# Altium schematic sheet POWER.SchDoc: =ProjectName
size A4; CheckedBy: DatNB; Author: Ven; CompanyName: Nacentech; Organization: IMET
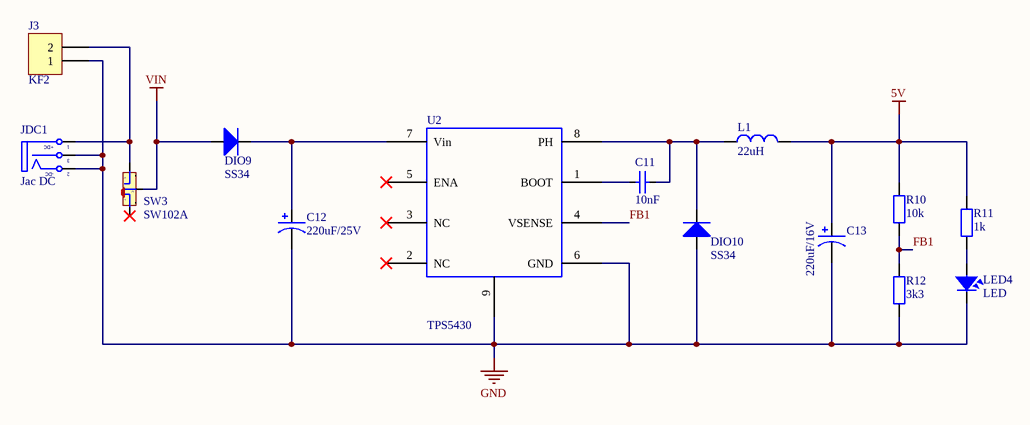
[diagram p0: POWER.SchDoc]

## Parts
C11  10nF  [CAP_0805]
C12  220uF/25V  [C8mm]
C13  220uF/16V  [C8mm]
DIO9  SS34  [DIO-214AC(SMA)]
DIO10  SS34  [DIO-214AC(SMA)]
J3  KF2  [KF2-5.08]
JDC1  Jac DC  [DC-IN]
L1  22uH  [L-SMD-M-7.3x4.5]
LED4  LED  [LED-0805-Red]
R10  10k  [RES-SMD-0805]
R11  1k  [RES-SMD-0805]
R12  3k3  [RES-SMD-0805]
SW3  SW102A  [SW102]
U2  TPS5430  [ESOP-8]

## Nets
5V: C13.1 L1.2 R10.1 R11.1
GND: C12.2 C13.2 DIO10.1(A) J3.1 JDC1.2(TN) JDC1.3(S) LED4.2 R12.2 U2.6(GND) U2.9(PWR_PAD)
VIN: DIO9.1(A) SW3.2
FB1: R10.2 R12.1 U2.4(VSENSE)
NetC11_1: C11.1 U2.1(BOOT)
NetC11_2: C11.2 DIO10.2(K) L1.1 U2.8(PH)
NetC12_1: C12.1 DIO9.2(K) U2.7(Vin)
NetJ3_2: J3.2 JDC1.1(T) SW3.3
NetLED4_1: LED4.1 R11.2

Not connected (* = marked no-connect by the designer): SW3 1* 4 5; U2 2(NC)* 3(NC)* 5(ENA)*

## Notes on the sheet
- Project:
- Page Contents:
- Size:
- Date:
- A4
- Checked by:
- Time:
- Revision:
- Sheet
- of
- File:
- (in symbol DCIN) +DC; -DC

## Library data of the parts
C11 = CapSMD: Capacitor; Value: 33p; Published: 8-Jun-2000; LatestRevisionDate: 17-Jul-2002; LatestRevisionNote: Re-released for DXP Platform.; PackageReference: RAD-0.3; Publisher: Altium Limited
C12 C13 = Cap Pol: Polarized Capacitor (Axial); Published: 8-Jun-2000; LatestRevisionDate: 17-Jul-2002; LatestRevisionNote: Re-released for DXP Platform.; PackageReference: POLAR0.8; Publisher: Altium Limited
DIO9 DIO10 = Diode SMD: Default Diode; Code - JEDEC: DO-214-AB; Value: 1N5007; Published: 8-Jun-2000; Revision: July-2002: Re-released for DXP Platform.; Publisher: Altium Limited
J3 = KF2: Manufacturer: Würth Elektronik eiSos GmbH; partNo: 691103110002; ComponentLink1 Description: Manufacturer; ComponentLink2 Description: Datasheet; NoPins: 2; Created Date: 29 October 2013; ComponentLink1URL: http://www.we-online.com; ComponentLink2URL: http://katalog.we-online.de/em/datasheet/6911031100xx.pdf; Created by: Karrer Zheng
JDC1 = DCIN: Jac DC input; Value: Jac DC
L1 = Inductor: Value: 150 mH
LED4 = LED: LED Single colour Green and Red; Value: LED 3 ly Single Colour
R10-R12 = Resistor - SMD: Resistor SMD; Manufacturer: Generic Components; Class: Passive; Published: 08/06/2000; Publisher: Altium Hobart Technology Centre
SW3 = SW102A: Switch 102 on Broad; Value: Switch 102 On Board
U2 = TPS5430: Name: TPS5430